# EAGLE design LCR (EAGLE 9.3.1)

## Sheet 1 of 3
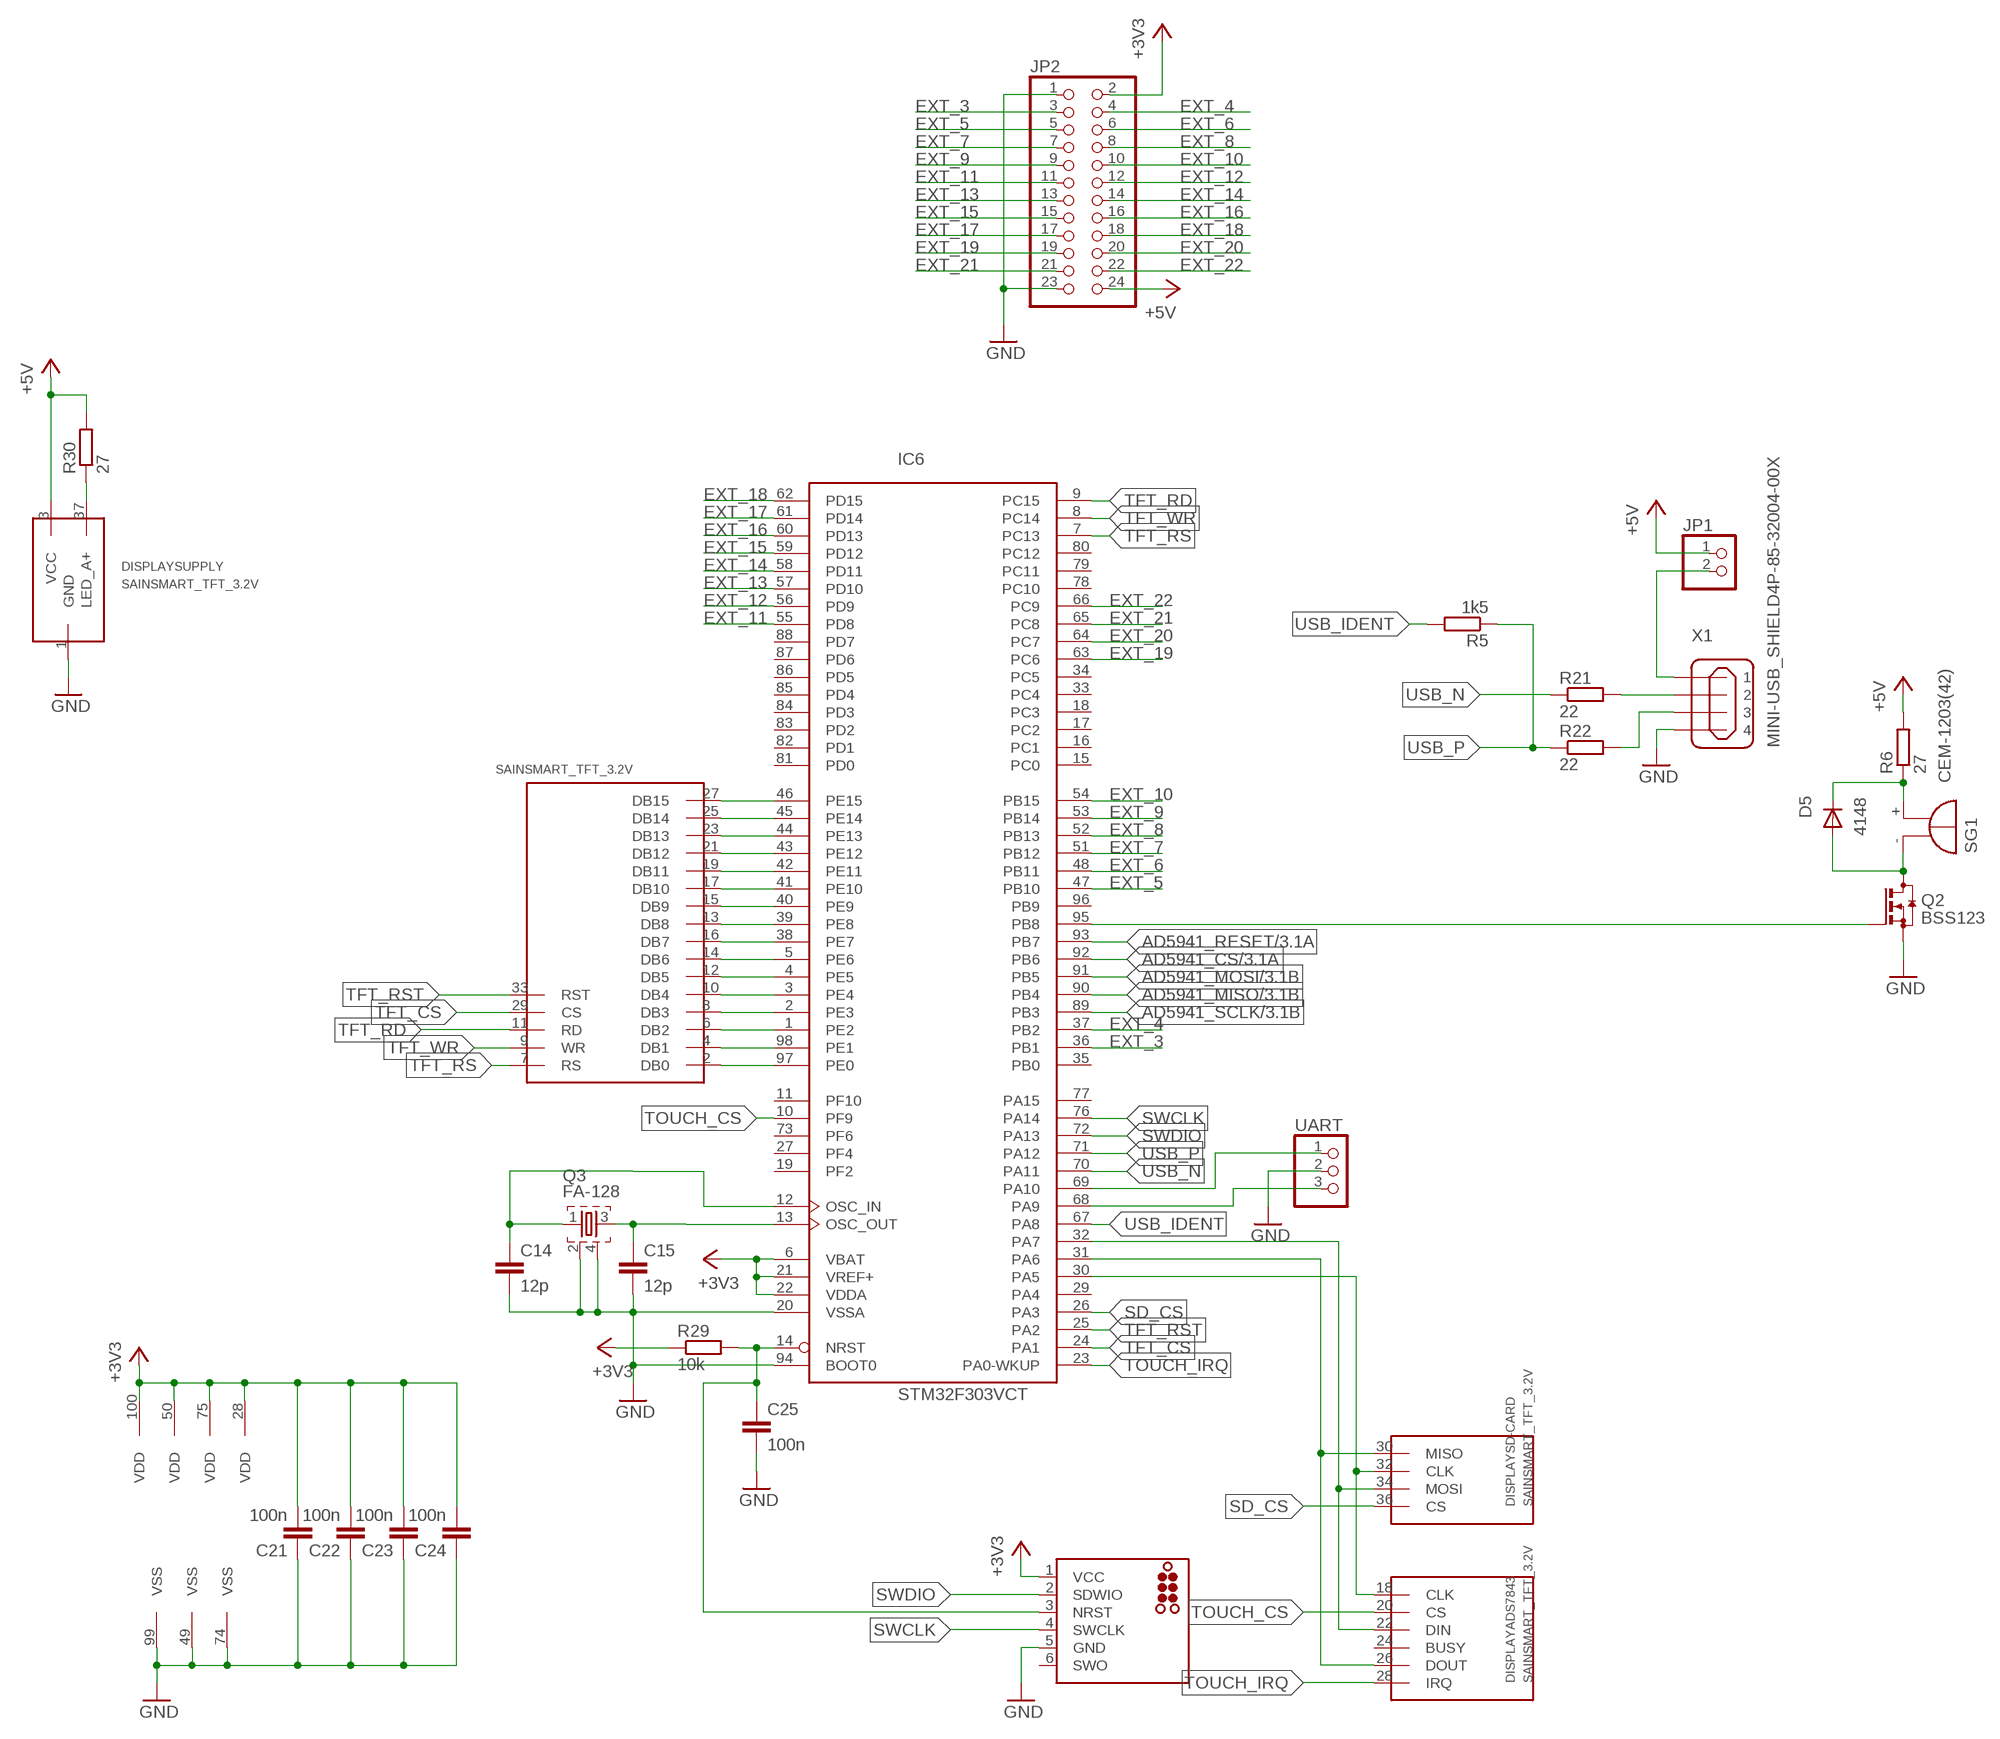
[diagram p0: schematic, sheet 1]

### Parts
C14  12p  C-EUC0603K  [C0603K]
C15  12p  C-EUC0603K  [C0603K]
C21  100n  C-EUC0603K  [C0603K]
C22  100n  C-EUC0603K  [C0603K]
C23  100n  C-EUC0603K  [C0603K]
C24  100n  C-EUC0603K  [C0603K]
C25  100n  C-EUC0603K  [C0603K]
D5  4148  DIODE-SOD123  [SOD123]
DISPLAY  SAINSMART_TFT_3.2V  [SAINSMART_ANGLED]
IC6  STM32F303VCT  [LQFP100]
J1  TC2030-MCP  [TC2030-MCP]
JP1  PINHD-1X2  [1X02]
JP2  PINHD-2X12  [2X12]
Q2  BSS123  [SOT23]
Q3  FA-128  [FA-128]
R5  1k5  R-EU_R0603  [R0603]
R6  27  R-EU_R1206  [R1206]
R21  22  R-EU_R0603  [R0603]
R22  22  R-EU_R0603  [R0603]
R29  10k  R-EU_R0603  [R0603]
R30  27  R-EU_R1206  [R1206]
SG1  CEM-1203(42)  F/QMBIII  [F/QMBIII]
UART  PINHD-1X3  [1X03]
X1  MINI-USB_SHIELD4P-85-32004-00X  [85-32004-00X]

### Nets
+3V3: C21.2 C22.2 C23.2 C24.2 IC6.6(VBAT) IC6.21(VREF+) IC6.22(VDDA) IC6.28(VDD) IC6.50(VDD) IC6.75(VDD) IC6.100(VDD) J1.1(VCC) JP2.2 R29.1 ; also sheet 2,3
+5V: DISPLAY.3(SUPPLY:VCC) JP1.1 JP2.24 R6.2 R30.2 ; also sheet 2
AD5941_CS: IC6.92(PB6) ; also sheet 3
AD5941_MISO: IC6.90(PB4) ; also sheet 3
AD5941_MOSI: IC6.91(PB5) ; also sheet 3
AD5941_RESET: IC6.93(PB7) ; also sheet 3
AD5941_SCLK: IC6.89(PB3) ; also sheet 3
EXT_3: IC6.36(PB1) JP2.3
EXT_4: IC6.37(PB2) JP2.4
EXT_5: IC6.47(PB10) JP2.5
EXT_6: IC6.48(PB11) JP2.6
EXT_7: IC6.51(PB12) JP2.7
EXT_8: IC6.52(PB13) JP2.8
EXT_9: IC6.53(PB14) JP2.9
EXT_10: IC6.54(PB15) JP2.10
EXT_11: IC6.55(PD8) JP2.11
EXT_12: IC6.56(PD9) JP2.12
EXT_13: IC6.57(PD10) JP2.13
EXT_14: IC6.58(PD11) JP2.14
EXT_15: IC6.59(PD12) JP2.15
EXT_16: IC6.60(PD13) JP2.16
EXT_17: IC6.61(PD14) JP2.17
EXT_18: IC6.62(PD15) JP2.18
EXT_19: IC6.63(PC6) JP2.19
EXT_20: IC6.64(PC7) JP2.20
EXT_21: IC6.65(PC8) JP2.21
EXT_22: IC6.66(PC9) JP2.22
GND: C14.2 C15.2 C21.1 C22.1 C23.1 C24.1 C25.2 DISPLAY.1(SUPPLY:GND) IC6.20(VSSA) IC6.49(VSS) IC6.74(VSS) IC6.94(BOOT0) IC6.99(VSS) J1.5(GND) JP2.1 JP2.23 Q2.2(S) Q3.2 Q3.4 UART.2 X1.4 ; also sheet 2,3
N$38: IC6.95(PB8) Q2.1(G)
N$41: DISPLAY.2(SSD1289:DB0) IC6.97(PE0)
N$43: DISPLAY.4(SSD1289:DB1) IC6.98(PE1)
N$44: DISPLAY.6(SSD1289:DB2) IC6.1(PE2)
N$45: DISPLAY.8(SSD1289:DB3) IC6.2(PE3)
N$46: DISPLAY.22(ADS7843:DIN) DISPLAY.34(SD-CARD:MOSI) IC6.32(PA7)
N$47: DISPLAY.10(SSD1289:DB4) IC6.3(PE4)
N$48: DISPLAY.12(SSD1289:DB5) IC6.4(PE5)
N$49: DISPLAY.14(SSD1289:DB6) IC6.5(PE6)
N$50: DISPLAY.16(SSD1289:DB7) IC6.38(PE7)
N$51: DISPLAY.26(ADS7843:DOUT) DISPLAY.30(SD-CARD:MISO) IC6.31(PA6)
N$52: DISPLAY.18(ADS7843:CLK) DISPLAY.32(SD-CARD:CLK) IC6.30(PA5)
N$53: C14.1 IC6.12(OSC_IN) Q3.1
N$54: C15.1 IC6.13(OSC_OUT) Q3.3
N$55: R21.2 X1.2
N$56: R22.2 X1.3
N$60: C25.1 IC6.14(NRST) J1.3(NRST) R29.2
N$61: DISPLAY.37(SUPPLY:LED_A+) R30.1
N$62: DISPLAY.13(SSD1289:DB8) IC6.39(PE8)
N$63: DISPLAY.15(SSD1289:DB9) IC6.40(PE9)
N$64: DISPLAY.17(SSD1289:DB10) IC6.41(PE10)
N$65: DISPLAY.19(SSD1289:DB11) IC6.42(PE11)
N$66: JP1.2 X1.1
N$67: D5.C R6.1 SG1.+(-)
N$68: DISPLAY.21(SSD1289:DB12) IC6.43(PE12)
N$69: DISPLAY.23(SSD1289:DB13) IC6.44(PE13)
N$70: DISPLAY.25(SSD1289:DB14) IC6.45(PE14)
N$71: DISPLAY.27(SSD1289:DB15) IC6.46(PE15)
N$72: D5.A Q2.3(D) SG1.-(+)
RX: IC6.69(PA10) UART.1
SD_CS: DISPLAY.36(SD-CARD:CS) IC6.26(PA3)
SWCLK: IC6.76(PA14) J1.4(SWCLK)
SWDIO: IC6.72(PA13) J1.2(SDWIO)
TFT_CS: DISPLAY.29(SSD1289:CS) IC6.24(PA1)
TFT_RD: DISPLAY.11(SSD1289:RD) IC6.9(PC15)
TFT_RS: DISPLAY.7(SSD1289:RS) IC6.7(PC13)
TFT_RST: DISPLAY.33(SSD1289:RST) IC6.25(PA2)
TFT_WR: DISPLAY.9(SSD1289:WR) IC6.8(PC14)
TOUCH_CS: DISPLAY.20(ADS7843:CS) IC6.10(PF9)
TOUCH_IRQ: DISPLAY.28(ADS7843:IRQ) IC6.23(PA0-WKUP)
TX: IC6.68(PA9) UART.3
USB_IDENT: IC6.67(PA8) R5.2
USB_N: IC6.70(PA11) R21.1
USB_P: IC6.71(PA12) R5.1 R22.1
Unconnected: DISPLAY.24(ADS7843:BUSY) IC6.11(PF10) IC6.15(PC0) IC6.16(PC1) IC6.17(PC2) IC6.18(PC3) IC6.19(PF2) IC6.27(PF4) IC6.29(PA4) IC6.33(PC4) IC6.34(PC5) IC6.35(PB0) IC6.73(PF6) IC6.77(PA15) IC6.78(PC10) IC6.79(PC11) IC6.80(PC12) IC6.81(PD0) IC6.82(PD1) IC6.83(PD2) IC6.84(PD3) IC6.85(PD4) IC6.86(PD5) IC6.87(PD6) IC6.88(PD7) IC6.96(PB9) J1.6(SWO) X1.M1(S1) X1.M2(S2)

## Sheet 2 of 3
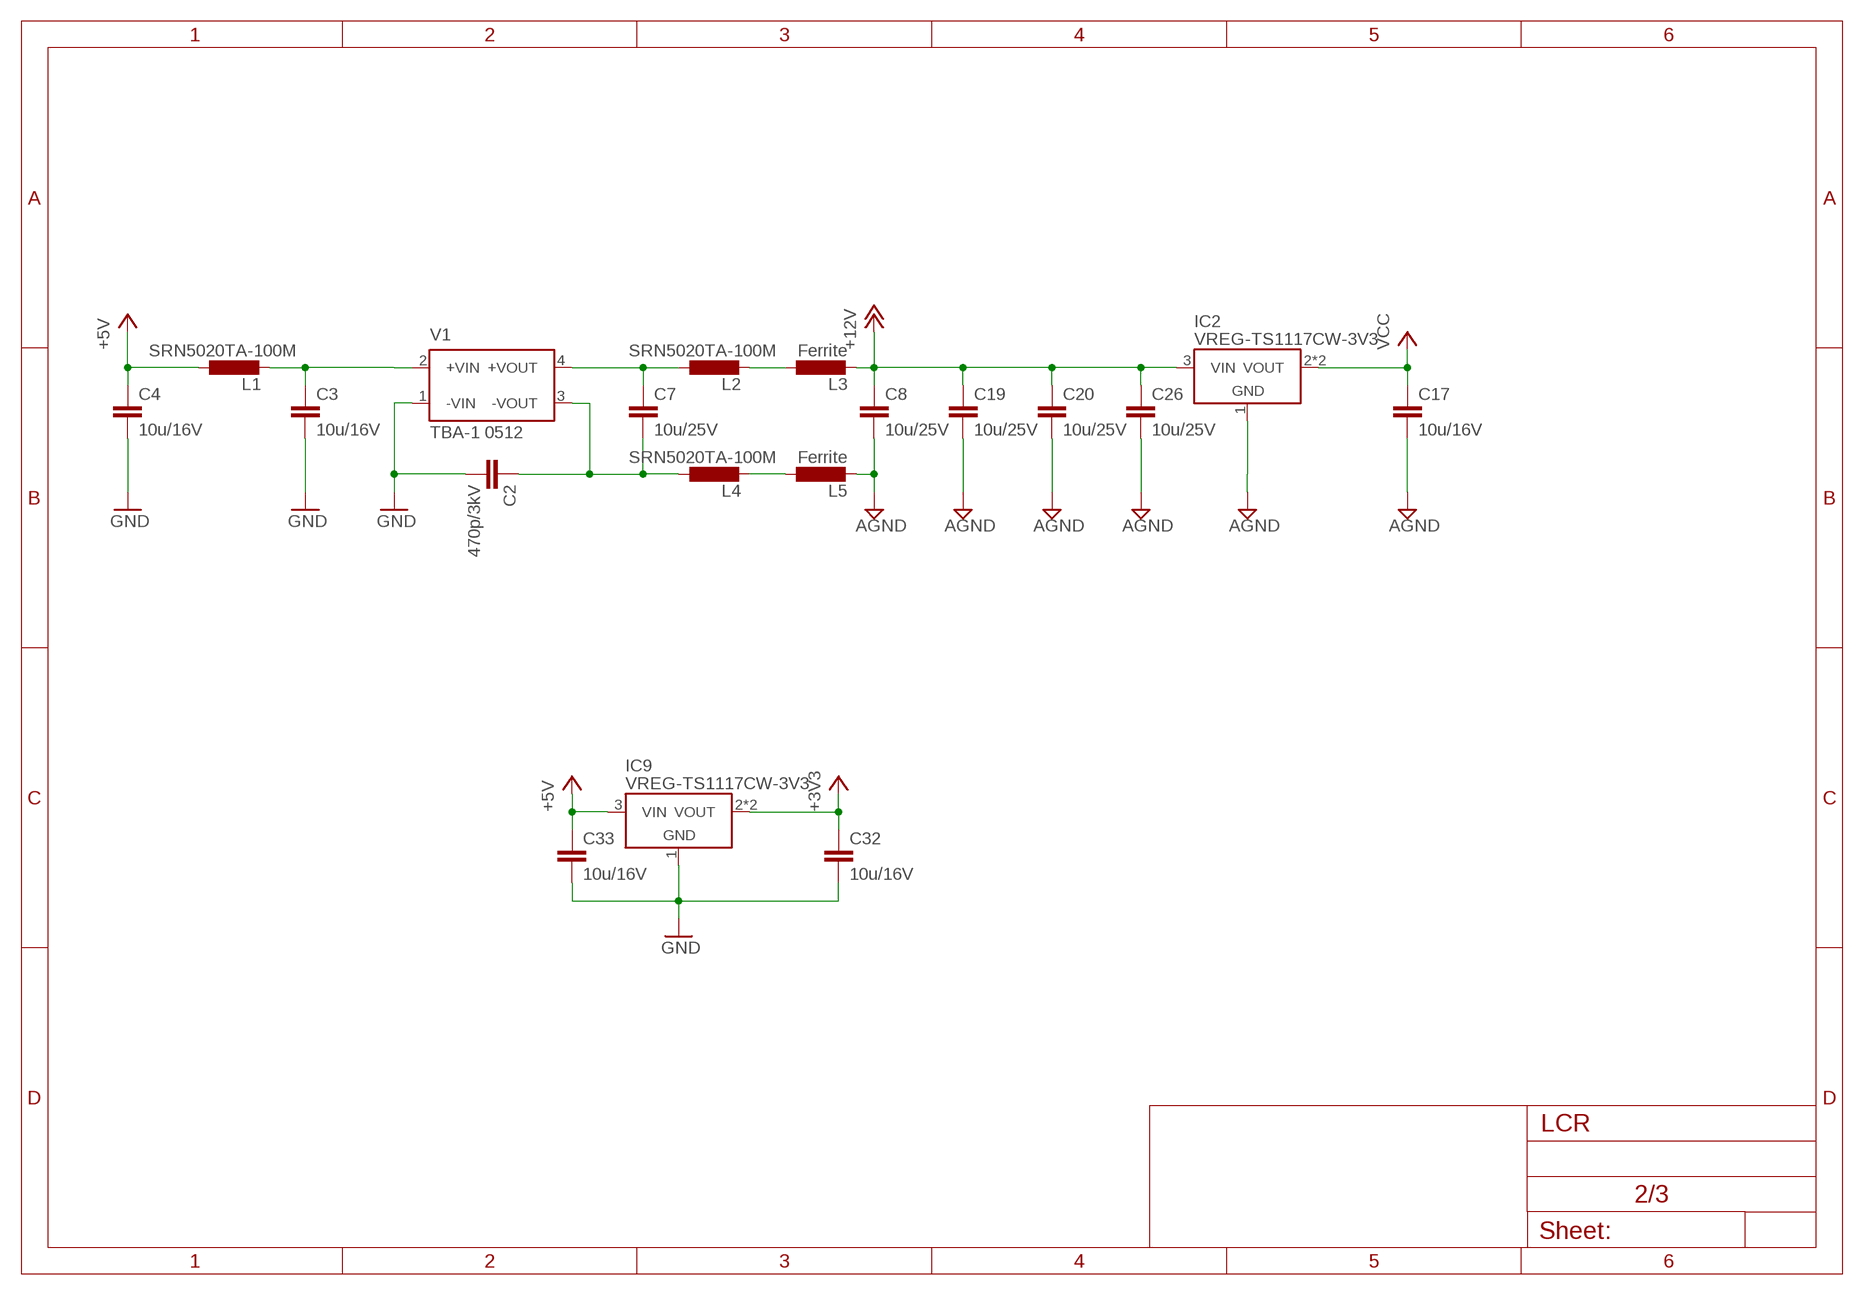
[diagram p1: schematic, sheet 2]

### Parts
C2  470p/3kV  C-EUC1812  [C1812]
C3  10u/16V  C-EUC1206K  [C1206K]
C4  10u/16V  C-EUC1206K  [C1206K]
C7  10u/25V  C-EUC1206K  [C1206K]
C8  10u/25V  C-EUC1206K  [C1206K]
C17  10u/16V  C-EUC1206K  [C1206K]
C19  10u/25V  C-EUC1206K  [C1206K]
C20  10u/25V  C-EUC1206K  [C1206K]
C26  10u/25V  C-EUC1206K  [C1206K]
C32  10u/16V  C-EUC1206K  [C1206K]
C33  10u/16V  C-EUC1206K  [C1206K]
IC2  VREG-TS1117CW-3V3  [SOT223]
IC9  VREG-TS1117CW-3V3  [SOT223]
L1  SRN5020TA-100M  SRN5040  [SRN5040]
L2  SRN5020TA-100M  SRN5040  [SRN5040]
L3  Ferrite  INDUCTOR0603  [R0603]
L4  SRN5020TA-100M  SRN5040  [SRN5040]
L5  Ferrite  INDUCTOR0603  [R0603]
V1  TBA-1 0512  TME0505S  [TME]

### Nets
+3V3: C32.1 IC9.2(VOUT) IC9.4(VOUT) ; also sheet 1,3
+5V: C4.1 C33.1 IC9.3(VIN) L1.P$1 ; also sheet 1
+12V: C8.1 C19.1 C20.1 C26.1 IC2.3(VIN) L3.2 ; also sheet 3
AGND: C8.2 C17.2 C19.2 C20.2 C26.2 IC2.1(GND) L5.2 ; also sheet 3
GND: C2.2 C3.2 C4.2 C32.2 C33.2 IC9.1(GND) V1.1(-VIN) ; also sheet 1,3
N$20: C3.1 L1.P$2 V1.2(+VIN)
N$25: C7.1 L2.P$1 V1.4(+VOUT)
N$26: C2.1 C7.2 L4.P$1 V1.3(-VOUT)
N$36: L2.P$2 L3.1
N$58: L4.P$2 L5.1
VCC: C17.1 IC2.2(VOUT) IC2.4(VOUT) ; also sheet 3

## Sheet 3 of 3
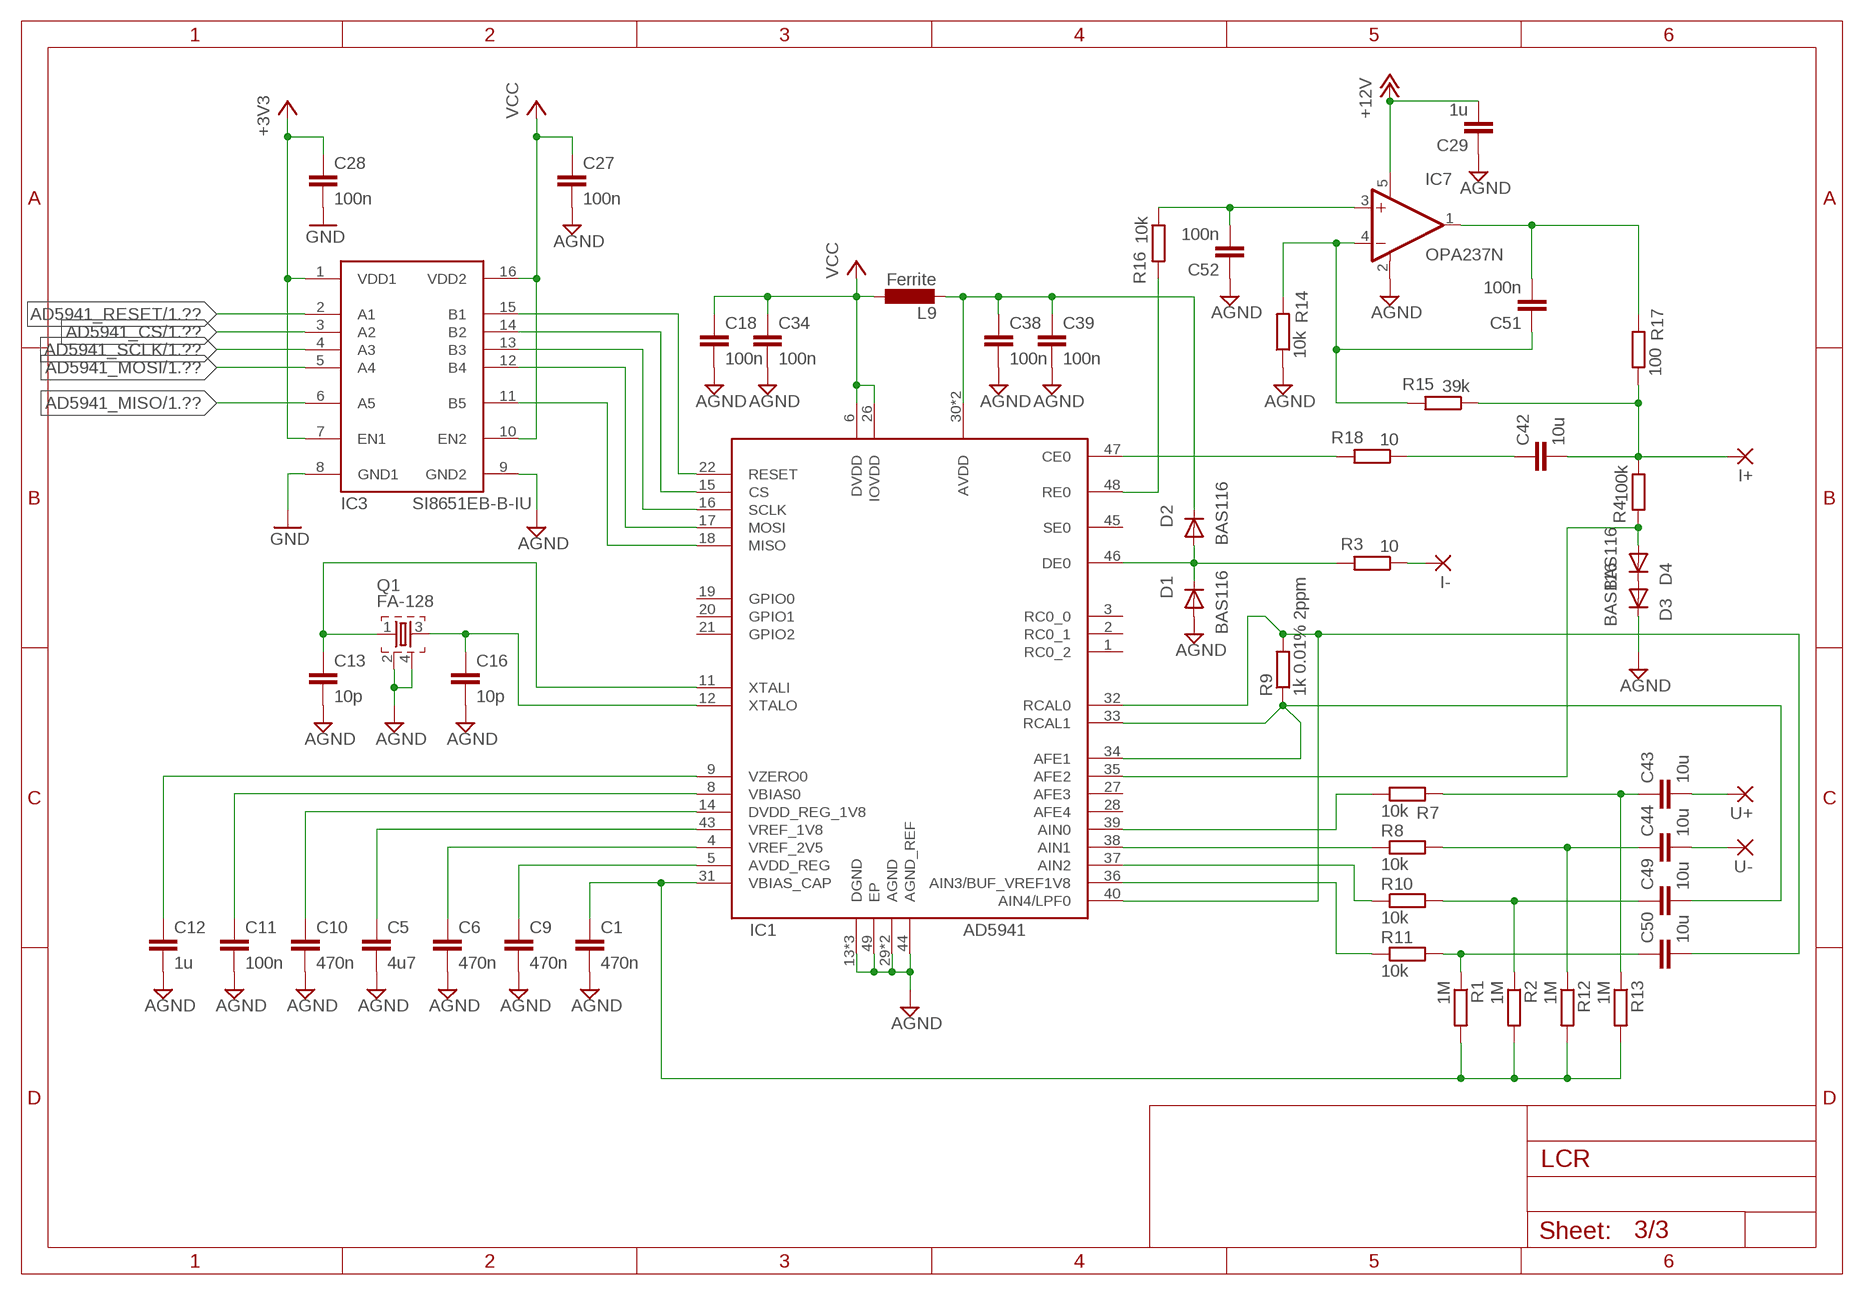
[diagram p2: schematic, sheet 3]

### Parts
C1  470n  C-EUC0603K  [C0603K]
C5  4u7  C-EUC0603K  [C0603K]
C6  470n  C-EUC0603K  [C0603K]
C9  470n  C-EUC0603K  [C0603K]
C10  470n  C-EUC0603K  [C0603K]
C11  100n  C-EUC0603K  [C0603K]
C12  1u  C-EUC0603K  [C0603K]
C13  10p  C-EUC0603K  [C0603K]
C16  10p  C-EUC0603K  [C0603K]
C18  100n  C-EUC0603K  [C0603K]
C27  100n  C-EUC0603K  [C0603K]
C28  100n  C-EUC0603K  [C0603K]
C29  1u  C-EUC0603K  [C0603K]
C34  100n  C-EUC0603K  [C0603K]
C38  100n  C-EUC0603K  [C0603K]
C39  100n  C-EUC0603K  [C0603K]
C42  10u  C-EUC1206K  [C1206K]
C43  10u  C-EUC1206K  [C1206K]
C44  10u  C-EUC1206K  [C1206K]
C49  10u  C-EUC1206K  [C1206K]
C50  10u  C-EUC1206K  [C1206K]
C51  100n  C-EUC0603K  [C0603K]
C52  100n  C-EUC0603K  [C0603K]
D1  BAS116  DIODE-SOD123  [SOD123]
D2  BAS116  DIODE-SOD123  [SOD123]
D3  BAS116  DIODE-SOD123  [SOD123]
D4  BAS116  DIODE-SOD123  [SOD123]
I+  2,54/1,1  [2,54/1,1]
I-  2,54/1,1  [2,54/1,1]
IC1  AD5941  [QFN50P700X700X80-49T510N]
IC3  SI8651EB-B-IU  [SOP63P600X175-16N]
IC7  OPA237N  [SOT23-5]
L9  Ferrite  INDUCTOR0603  [R0603]
Q1  FA-128  [FA-128]
R1  1M  R-EU_R0603  [R0603]
R2  1M  R-EU_R0603  [R0603]
R3  10  R-EU_R0603  [R0603]
R4  100k  R-EU_R0603  [R0603]
R7  10k  R-EU_R0603  [R0603]
R8  10k  R-EU_R0603  [R0603]
R9  1k 0.01% 2ppm  R-EU_M0805  [M0805]
R10  10k  R-EU_R0603  [R0603]
R11  10k  R-EU_R0603  [R0603]
R12  1M  R-EU_R0603  [R0603]
R13  1M  R-EU_R0603  [R0603]
R14  10k  R-EU_R0603  [R0603]
R15  39k  R-EU_R0603  [R0603]
R16  10k  R-EU_R0603  [R0603]
R17  100  R-EU_R0603  [R0603]
R18  10  R-EU_R0603  [R0603]
U+  2,54/1,1  [2,54/1,1]
U-  2,54/1,1  [2,54/1,1]

### Nets
+3V3: C28.1 IC3.1(VDD1) IC3.7(EN1) ; also sheet 1,2
+12V: C29.2 IC7.5(V+) ; also sheet 2
AD5941_CS: IC3.3(A2) ; also sheet 1
AD5941_MISO: IC3.6(A5) ; also sheet 1
AD5941_MOSI: IC3.5(A4) ; also sheet 1
AD5941_RESET: IC3.2(A1) ; also sheet 1
AD5941_SCLK: IC3.4(A3) ; also sheet 1
AGND: C1.2 C5.2 C6.2 C9.2 C10.2 C11.2 C12.2 C13.2 C16.2 C18.2 C27.2 C29.1 C34.2 C38.2 C39.2 C52.1 D1.A D3.C IC1.13(DGND) IC1.23(DGND) IC1.25(DGND) IC1.29(AGND) IC1.42(AGND) IC1.44(AGND_REF) IC1.49(EP) IC3.9(GND2) IC7.2(V-) Q1.2 Q1.4 R14.1 ; also sheet 2
GND: C28.2 IC3.8(GND1) ; also sheet 1,2
I+: C42.2 I+.1(P) R4.1 R15.1 R17.1
I-: I-.1(P) R3.1
N$1: C1.1 IC1.31(VBIAS_CAP) R1.2 R2.2 R12.2 R13.2
N$2: C6.1 IC1.4(VREF_2V5)
N$3: C5.1 IC1.43(VREF_1V8)
N$4: C9.1 IC1.5(AVDD_REG)
N$5: C10.1 IC1.14(DVDD_REG_1V8)
N$6: C11.1 IC1.8(VBIAS0)
N$7: C12.1 IC1.9(VZERO0)
N$8: C16.1 IC1.12(XTALO) Q1.3
N$9: C13.1 IC1.11(XTALI) Q1.1
N$10: IC1.17(MOSI) IC3.12(B4)
N$11: C42.1 R18.1
N$12: IC1.22(RESET) IC3.15(B1)
N$13: IC1.15(CS) IC3.14(B2)
N$14: IC1.16(SCLK) IC3.13(B3)
N$15: IC1.18(MISO) IC3.11(B5)
N$16: C38.1 C39.1 D2.C IC1.30(AVDD) IC1.41(AVDD) L9.2
N$17: IC1.47(CE0) R18.2
N$18: IC1.39(AIN0) R7.1
N$19: IC1.38(AIN1) R8.1
N$21: C44.1 R8.2 R12.1
N$23: C43.1 R7.2 R13.1
N$24: C49.2 IC1.33(RCAL1) IC1.34(AFE1) R9.1
N$27: IC1.37(AIN2) R10.1
N$28: IC1.36(AIN3/BUF_VREF1V8) R11.1
N$29: C50.1 R1.1 R11.2
N$30: C49.1 R2.1 R10.2
N$31: IC1.48(RE0) R16.2
N$32: C52.2 IC7.3(+IN) R16.1
N$33: C51.1 IC7.4(-IN) R14.2 R15.2
N$34: C51.2 IC7.1(OUT) R17.2
N$35: D1.C D2.A IC1.46(DE0) R3.2
N$37: D4.A IC1.35(AFE2) R4.2
N$39: D3.A D4.C
N$59: C50.2 IC1.32(RCAL0) IC1.40(AIN4/LPF0) R9.2
U+: C43.2 U+.1(P)
U-: C44.2 U-.1(P)
VCC: C18.1 C27.1 C34.1 IC1.6(DVDD) IC1.26(IOVDD) IC3.10(EN2) IC3.16(VDD2) L9.1 ; also sheet 2
Unconnected: IC1.1(RC0_2) IC1.2(RC0_1) IC1.3(RC0_0) IC1.19(GPIO0) IC1.20(GPIO1) IC1.21(GPIO2) IC1.27(AFE3) IC1.28(AFE4) IC1.45(SE0)

## Library data of the parts
C1 C3-C29 C32-C34 C38 C39 C51 C52 = rcl:C-EU: CAPACITOR, European symbol
C2 C42-C44 C49 C50 = resistor:C-EU: CAPACITOR, European symbol
D1-D5 = diode:DIODE-: DIODE
DISPLAY = sainsmart:SAINSMART_TFT_3.2
I+ I- U+ U- = wirepad:2,54/1,1: THROUGH-HOLE PAD
IC1 = custom-ic:AD5941
IC2 IC9 = we-power-mod:VREG: Voltage Regulators (LDOs, Switching Converters...) LDOs Taiwan Semi TS1117 800mA max 15V - compatible On Semi NCP1117 1A max 20V - compatible Diodes AP2111H 0.6A max 6V (0.25V@0.6A) - compatible Diodes AP2114H 1A max 6V (0.45V@1A) Taiwan Semi TS9011 250mA max 12V - compatible Diodes AP2210 300mA max 15V - compatible Microchip MCP1700 250mA max 6.5V - compatible Microchip MCP1702 250mA max 13V - compatible Microchip MCP1703 250mA max 16V - compatible Microchip MCP1754 150mA max 16V Taiwan Semi TS5204 150mA max 16V (low noise) DC/DC Converter Modules Recom R-78Ex.x-1.0-W36 1A max 28V - compatible CUI V78xx-2000 2A max 18V Murata OKI-78SR-x.x/1.5-W36 1.5A max 36V
IC3 = custom-ic:SI8651
IC6 = micro-stm_v3:STM32F303V*T: ARM 32-bit Cortex™-M3 CPU 72 MHz maximum frequency 128 to 256 Kbytes of Flash memory 32 to 40 kbytes of SRAM 87 GPIOs 2.0 to 3.6 V application supply
IC7 = burr-brown:OPA237: Operational Amplifiers Single-Supply, MicroAmplifier(TM) Series; MF: TEXAS INSTRUMENTS; MPN: OPA237NA/250; OC_FARNELL: 4625298; OC_NEWARK: 35C1874
J1 = tag-connect:TC2030: TAG-CONNECT ICSP Connector Manufacturer: Tag-Connect <http://www.tag-connect.com> Cable for easy In-Circuit Serial Programming. Designed for Microchip ICD2, suitable for many others. Two variants - one "with legs" (for hands-free fit on PCB) and another "without legs" for quick programming. PAD Description 1 MCLR/Vpp 2 Vdd 3 GND 4 PGD (ISPDAT) 5 PGC (ISPCLK) 6 nc (used for LVP) ©2009 ROFA.cz - modified and updated by Robert Darlington ‹rdarlington@gmail.com›
JP1 = pinhead:PINHD-1X2: PIN HEADER
JP2 = pinhead:PINHD-2X12: PIN HEADER
L1 L2 L4 = custom-ic:SRN5040
L3 L5 L9 = rf:INDUCTOR
Q1 Q3 = crystal:FA-: MHz RANGE CRYSTAL UNIT Source: Epson Toyocom
Q2 = transistor-small-signal:BSS123: N-CHANNEL MOS FET
R1-R4 R7 R8 R10-R18 = rcl:R-EU_: RESISTOR, European symbol
R5 R6 R9 R21 R22 R29 R30 = resistor:R-EU_: RESISTOR, European symbol
SG1 = buzzer:F/QMBIII: BUZZER Source: Buerklin; OC_FARNELL: unknown; OC_NEWARK: unknown
UART = pinhead:PINHD-1X3: PIN HEADER
V1 = traco-electronic:TME?*: DC/DC Converter TME Series 1 Watt Source: www.tracopower.com .. tme.pdf; MPN: TME 0505S; OC_FARNELL: 1007538; OC_NEWARK: 51R5321
X1 = con-cypressindustries:MINI-USB_SHIELD4P-: MINI USB 4 Pol. Source: www.cypressindustries.com; OC_FARNELL: unknown; OC_NEWARK: unknown

## Board
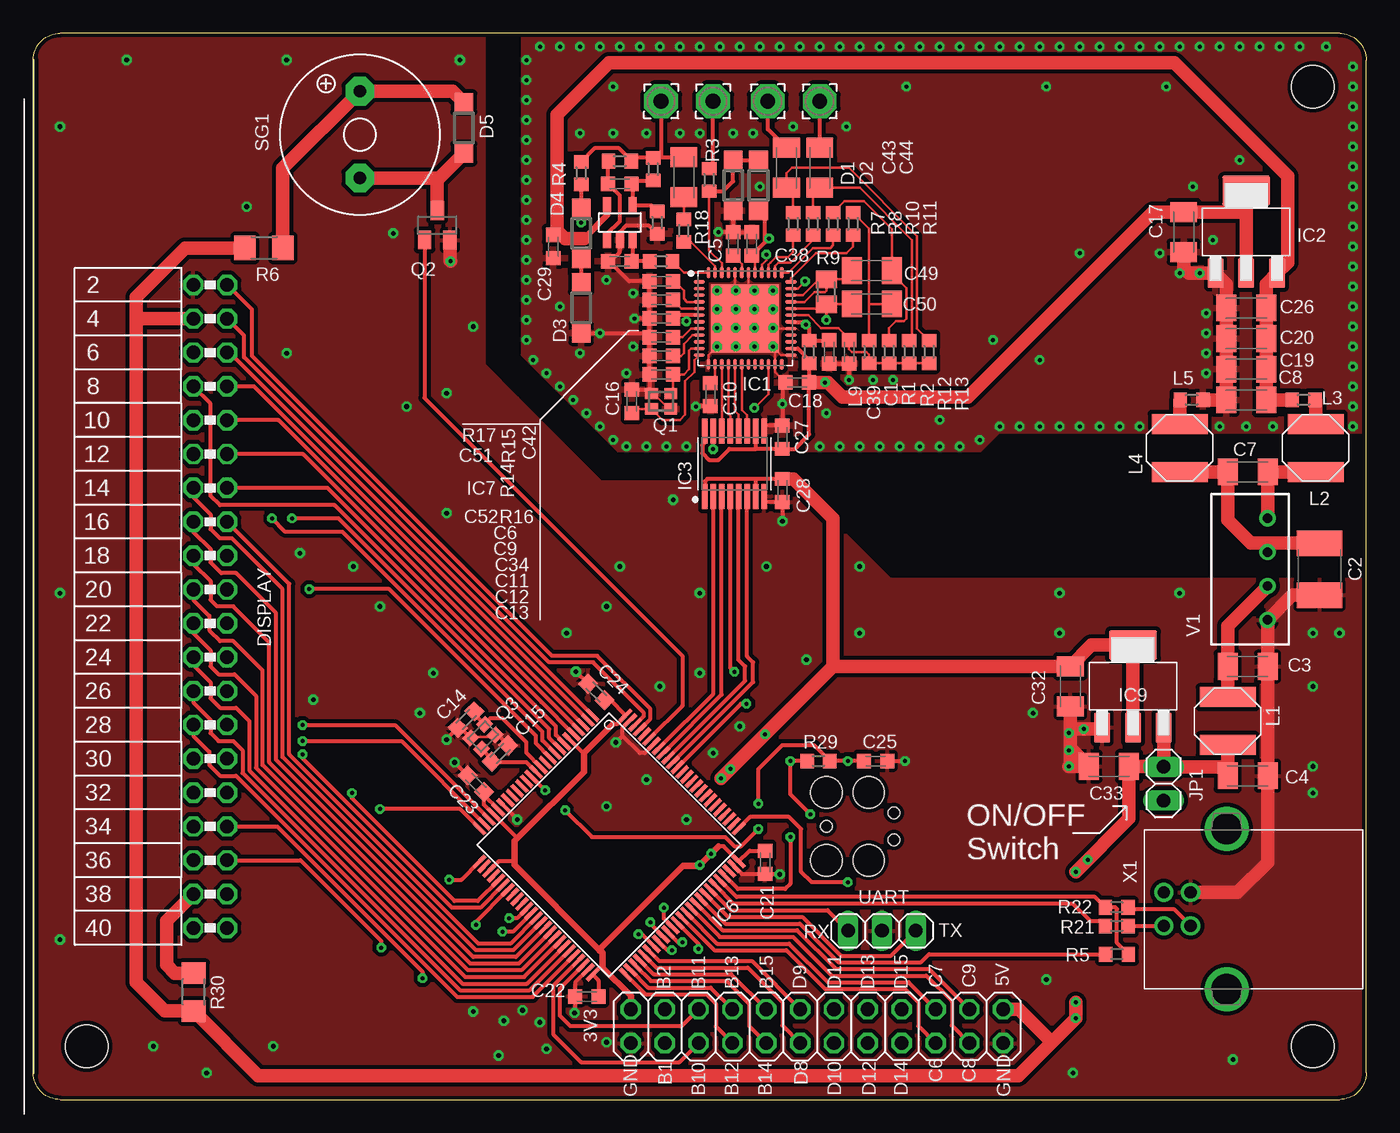
[diagram p3: board, top side]
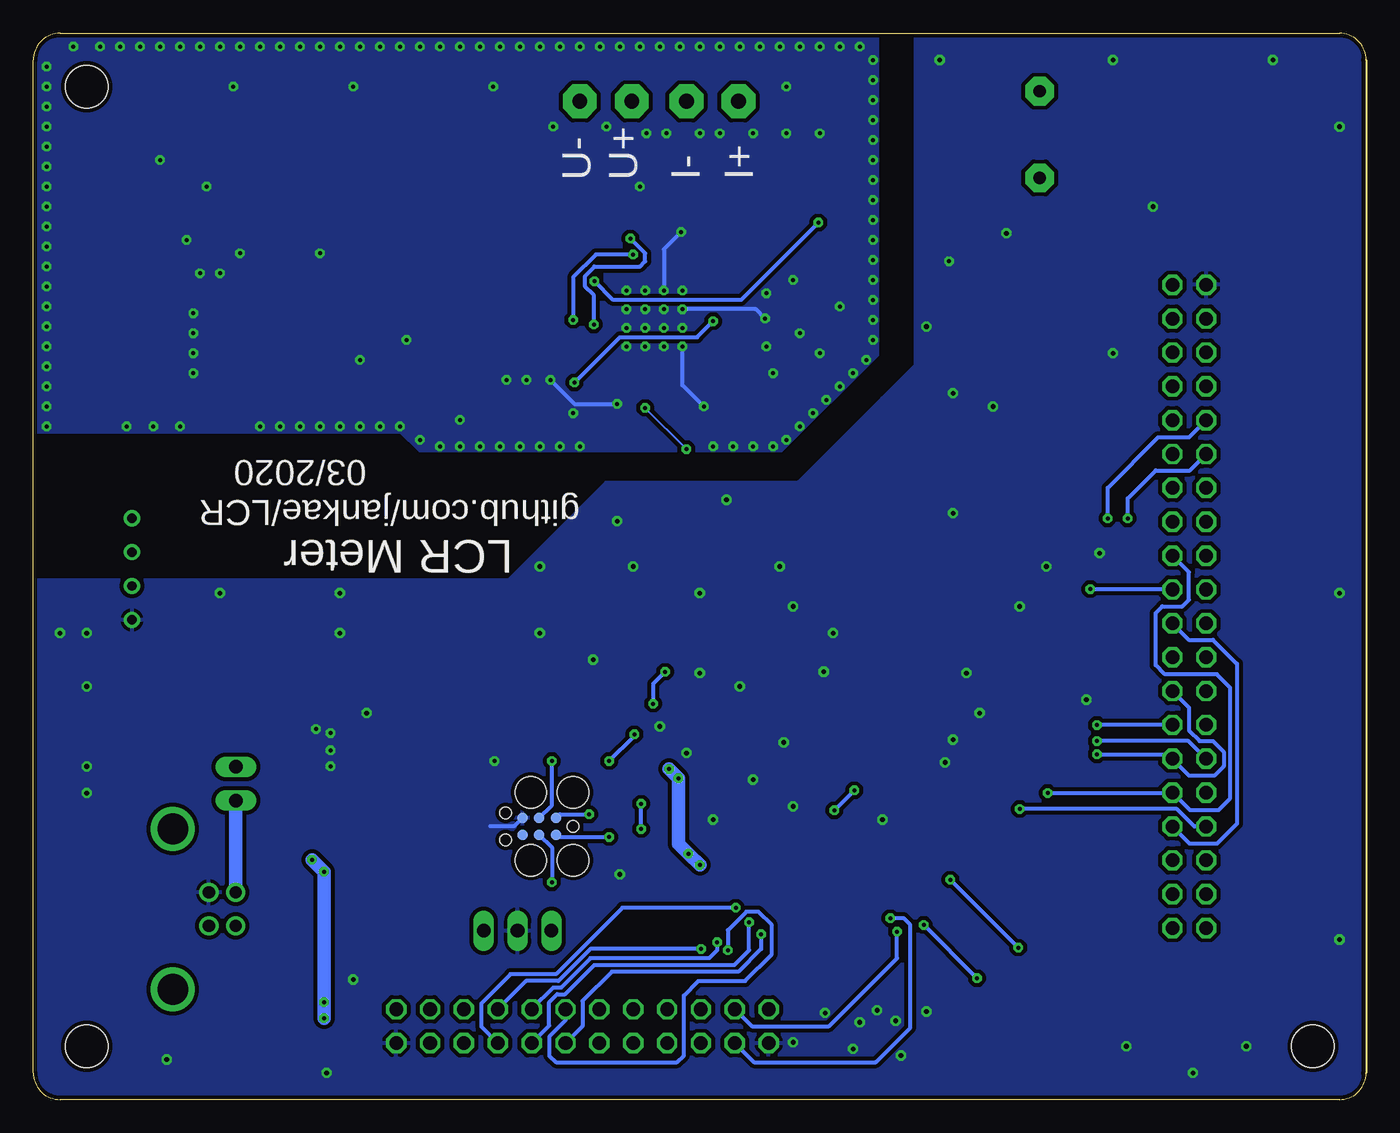
[diagram p4: board, bottom side, seen from below]

Size 100 x 80 mm. Coordinates in mm from the lower left corner, seen from the top.
Outline: 0,78 0,2
Outline: 0,78 0,2
Outline: 0,2 arc90 2,0 98,0 arc90 100,2 100,78 arc90 98,80 2,80 arc90 0,78
Copper layers (1*16): Top 0.035mm / dielectric 1.55mm / Bottom 0.035mm
Design rules "JLCPCB4L_7628 *": minimum track width 6mil, minimum drill 0.3mm, track to track 3.5mil, track to pad 3.5mil, pad to pad 3.5mil, via to via 3.5mil, smd to smd 0mil, copper to edge 0.2mm, drill to drill 0.2mm, minimum pad ring 10mil, minimum via ring 8mil, stop-mask expansion 4mil, vias tented up to drill 0mil, thermal gap 10mil
Holes 3.2 mm at 96,4 96,76 4,4
tKeepout: area 93,73 to 99,79; area 93,1 to 99,7; area 1,1 to 7,7

### Footprints (pad centres in the part's own frame; a part is rotated, then mirrored left to right if it is on the bottom)
C0603K = smd 1.05 x 1.08: 1 -0.875,0; 2 0.875,0
C1812 = smd 1.9 x 3.4: 1 -1.95,0; 2 1.95,0
C1206K = smd 1.5 x 2: 1 -1.5,0; 2 1.5,0
SOD123 = smd 1.4 x 1.4: A 1.9,0; C -1.9,0
SAINSMART_ANGLED = drill 1.016 octagon: 1 -24.13,0; 2 -24.13,2.54; 3 -21.59,0; 4 -21.59,2.54; 5 -19.05,0; 6 -19.05,2.54; 7 -16.51,0; 8 -16.51,2.54; 9 -13.97,0; 10 -13.97,2.54; 11 -11.43,0; 12 -11.43,2.54; 13 -8.89,0; 14 -8.89,2.54; 15 -6.35,0; 16 -6.35,2.54; 17 -3.81,0; 18 -3.81,2.54; 19 -1.27,0; 20 -1.27,2.54; 21 1.27,0; 22 1.27,2.54; 23 3.81,0; 24 3.81,2.54; 25 6.35,0; 26 6.35,2.54; 27 8.89,0; 28 8.89,2.54; 29 11.43,0; 30 11.43,2.54; 31 13.97,0; 32 13.97,2.54; 33 16.51,0; 34 16.51,2.54; 35 19.05,0; 36 19.05,2.54; 37 21.59,0; 38 21.59,2.54; 39 24.13,0; 40 24.13,2.54
2,54/1,1 = drill 1.118 pad 2.54 octagon: 1 0,0
QFN50P700X700X80-49T510N = smd 0.838 x 0.264: 1 -3.446,2.75; 2 -3.446,2.25; 3 -3.446,1.75; 4 -3.446,1.25; 5 -3.446,0.75; 6 -3.446,0.25; 7 -3.446,-0.25; 8 -3.446,-0.75; 9 -3.446,-1.25; 10 -3.446,-1.75; 11 -3.446,-2.25; 12 -3.446,-2.75; 25 3.446,-2.75; 26 3.446,-2.25; 27 3.446,-1.75; 28 3.446,-1.25; 29 3.446,-0.75; 30 3.446,-0.25; 31 3.446,0.25; 32 3.446,0.75; 33 3.446,1.25; 34 3.446,1.75; 35 3.446,2.25; 36 3.446,2.75 | smd 0.264 x 0.838: 13 -2.75,-3.446; 14 -2.25,-3.446; 15 -1.75,-3.446; 16 -1.25,-3.446; 17 -0.75,-3.446; 18 -0.25,-3.446; 19 0.25,-3.446; 20 0.75,-3.446; 21 1.25,-3.446; 22 1.75,-3.446; 23 2.25,-3.446; 24 2.75,-3.446; 37 2.75,3.446; 38 2.25,3.446; 39 1.75,3.446; 40 1.25,3.446; 41 0.75,3.446; 42 0.25,3.446; 43 -0.25,3.446; 44 -0.75,3.446; 45 -1.25,3.446; 46 -1.75,3.446; 47 -2.25,3.446; 48 -2.75,3.446 | smd 5.1 x 5.1: 49 0,0
SOT223 = smd 2.235 x 1.219: 1 -3.099,2.311; 2 -3.099,0; 3 -3.099,-2.311 | smd 2.2 x 3.6: 4 3.099,0
SOP63P600X175-16N = smd 1.901 x 0.41: 1 -2.455,2.223; 2 -2.455,1.587; 3 -2.455,0.953; 4 -2.455,0.318; 5 -2.455,-0.318; 6 -2.455,-0.953; 7 -2.455,-1.587; 8 -2.455,-2.223; 9 2.455,-2.223; 10 2.455,-1.587; 11 2.455,-0.953; 12 2.455,-0.318; 13 2.455,0.318; 14 2.455,0.953; 15 2.455,1.587; 16 2.455,2.223
LQFP100 = smd 0.3 x 1.2: 1 -6,-7.75; 2 -5.5,-7.75; 3 -5,-7.75; 4 -4.5,-7.75; 5 -4,-7.75; 6 -3.5,-7.75; 7 -3,-7.75; 8 -2.5,-7.75; 9 -2,-7.75; 10 -1.5,-7.75; 11 -1,-7.75; 12 -0.5,-7.75; 13 0,-7.75; 14 0.5,-7.75; 15 1,-7.75; 16 1.5,-7.75; 17 2,-7.75; 18 2.5,-7.75; 19 3,-7.75; 20 3.5,-7.75; 21 4,-7.75; 22 4.5,-7.75; 23 5,-7.75; 24 5.5,-7.75; 25 6,-7.75; 51 6,7.75; 52 5.5,7.75; 53 5,7.75; 54 4.5,7.75; 55 4,7.75; 56 3.5,7.75; 57 3,7.75; 58 2.5,7.75; 59 2,7.75; 60 1.5,7.75; 61 1,7.75; 62 0.5,7.75; 63 0,7.75; 64 -0.5,7.75; 65 -1,7.75; 66 -1.5,7.75; 67 -2,7.75; 68 -2.5,7.75; 69 -3,7.75; 70 -3.5,7.75; 71 -4,7.75; 72 -4.5,7.75; 73 -5,7.75; 74 -5.5,7.75; 75 -6,7.75 | smd 1.2 x 0.3: 26 7.75,-6; 27 7.75,-5.5; 28 7.75,-5; 29 7.75,-4.5; 30 7.75,-4; 31 7.75,-3.5; 32 7.75,-3; 33 7.75,-2.5; 34 7.75,-2; 35 7.75,-1.5; 36 7.75,-1; 37 7.75,-0.5; 38 7.75,0; 39 7.75,0.5; 40 7.75,1; 41 7.75,1.5; 42 7.75,2; 43 7.75,2.5; 44 7.75,3; 45 7.75,3.5; 46 7.75,4; 47 7.75,4.5; 48 7.75,5; 49 7.75,5.5; 50 7.75,6; 76 -7.75,6; 77 -7.75,5.5; 78 -7.75,5; 79 -7.75,4.5; 80 -7.75,4; 81 -7.75,3.5; 82 -7.75,3; 83 -7.75,2.5; 84 -7.75,2; 85 -7.75,1.5; 86 -7.75,1; 87 -7.75,0.5; 88 -7.75,0; 89 -7.75,-0.5; 90 -7.75,-1; 91 -7.75,-1.5; 92 -7.75,-2; 93 -7.75,-2.5; 94 -7.75,-3; 95 -7.75,-3.5; 96 -7.75,-4; 97 -7.75,-4.5; 98 -7.75,-5; 99 -7.75,-5.5; 100 -7.75,-6
SOT23-5 = smd 0.6 x 1.2: 1 -0.95,-1.306; 2 0,-1.306; 3 0.95,-1.306; 4 0.95,1.306; 5 -0.95,1.306
TC2030-MCP = smd 0.787 x 0.787: 1 1.27,-0.635; 2 1.27,0.635; 3 2.54,-0.635; 4 2.54,0.635; 5 3.81,-0.635; 6 3.81,0.635 | hole 0.889: 0,0; 5.08,-1.016; 5.08,1.016 | hole 2.375: 0,2.54; 0,-2.54; 3.175,-2.54; 3.175,2.54
1X02 = drill 1.016 long: 1 -1.27,0; 2 1.27,0
2X12 = drill 1.016 octagon: 1 -13.97,-1.27; 2 -13.97,1.27; 3 -11.43,-1.27; 4 -11.43,1.27; 5 -8.89,-1.27; 6 -8.89,1.27; 7 -6.35,-1.27; 8 -6.35,1.27; 9 -3.81,-1.27; 10 -3.81,1.27; 11 -1.27,-1.27; 12 -1.27,1.27; 13 1.27,-1.27; 14 1.27,1.27; 15 3.81,-1.27; 16 3.81,1.27; 17 6.35,-1.27; 18 6.35,1.27; 19 8.89,-1.27; 20 8.89,1.27; 21 11.43,-1.27; 22 11.43,1.27; 23 13.97,-1.27; 24 13.97,1.27
SRN5040 = smd 1.5 x 4.2: P$1 -1.8,0; P$2 1.8,0
R0603 = smd 1 x 1.1: 1 -0.85,0; 2 0.85,0
FA-128 = smd 0.95 x 0.85: 1 -0.725,-0.575; 2 0.725,-0.575; 3 0.725,0.575; 4 -0.725,0.575
SOT23 = smd 1 x 1.4: 1 -0.95,-1.1; 2 0.95,-1.1; 3 0,1.1
R1206 = smd 1.6 x 1.803: 1 -1.422,0; 2 1.422,0
M0805 = smd 1.3 x 1.6: 1 -0.95,0; 2 0.95,0
F/QMBIII = drill 0.914 pad 2.159 octagon: + 3.251,0; - -3.251,0
1X03 = drill 1.016 long: 1 -2.54,0; 2 0,0; 3 2.54,0
TME = drill 0.7 pad 1.1: 1 -3.81,0; 2 -1.27,0; 3 1.27,0; 4 3.81,0
85-32004-00X = drill 0.92 pad 1.27: 1 4.71,-1.25; 2 4.71,1.25; 3 2.71,1.25; 4 2.71,-1.25 | drill 2.3 pad 3: M1 0,6.02; M2 0,-6.02

### Placement (x,y rotation side)
C1  61.2,56.1 270 top
C2  96.5,39.8 270 top
C3  91.1,32.5 0 top
C4  91.1,24.3 0 top
C5  52.5,64.2 90 top
C6  47.1,61.4 180 top
C7  91.1,47.1 180 top
C8  91,52.5 180 top
C9  47.1,60 180 top
C10  50.8,52.9 270 top
C11  47.1,57.2 180 top
C12  47.1,55.8 180 top
C13  47.1,54.4 180 top
C14  32.47,28.51 225 top
C15  35.01,25.97 45 top
C16  44.9,52.4 90 top
C17  86.3,65.1 270 top
C18  57.3,53.8 180 top
C19  91,54.8 180 top
C20  91,57.1 180 top
C21  54.9,17.8 90 top
C22  41.53,7.73 0 top
C23  33.2,23.7 315 top
C24  42.24,30.58 315 top
C25  63.2,25.4 0 top
C26  91,59.4 180 top
C27  56.2,49.7 90 top
C28  56.2,45.7 270 top
C29  39,64 90 top
C32  77.8,31 270 top
C33  80.7,25 180 top
C34  47.1,58.6 180 top
C38  53.9,64.2 90 top
C39  59.7,56.1 270 top
C42  48.8,69.2 90 top
C43  56.5,69.9 90 top
C44  59,69.9 90 top
C49  62.9,62.2 180 top
C50  62.9,59.7 180 top
C51  44,68.7 180 top
C52  44,62.9 0 top
D1  52.5,68.6 270 top
D2  54.4,68.6 90 top
D3  41.1,59.4 90 top
D4  41.1,65 90 top
D5  32.3,72.9 270 top
DISPLAY  12,37 270 top
I+  47.1,74.9 90 top
I-  51,74.9 90 top
IC1  53.4,58.6 0 top
IC2  91,65.1 90 top
IC3  52.6,47.7 90 top
IC6  43.2,19.1 225 top
IC7  44,65.8 0 top
IC9  82.5,31 90 top
J1  59.5,20.5 180 bottom
JP1  84.8,23.7 270 top
JP2  58.8,5.5 0 top
L1  89.6,28.4 90 top
L2  96.2,48.9 90 top
L3  95.3,52.5 180 top
L4  86,48.9 90 top
L5  86.9,52.5 0 top
L9  58.2,56.1 90 top
Q1  47.1,52.4 180 top
Q2  30.3,65.6 0 top
Q3  33.74,27.24 225 top
R1  62.7,56.1 270 top
R2  64.2,56.1 270 top
R3  50.7,69 270 top
R4  41.1,69.5 270 top
R5  81.3,10.9 180 top
R6  17.3,63.9 180 top
R7  57,65.7 90 top
R8  58.5,65.7 90 top
R9  59.5,60.6 270 top
R10  60,65.7 90 top
R11  61.5,65.7 90 top
R12  65.7,56.1 270 top
R13  67.2,56.1 270 top
R14  46.8,65.8 90 top
R15  46.5,69.8 270 top
R16  47.1,62.9 0 top
R17  44,70.4 180 top
R18  48.8,65.2 270 top
R21  81.28,13.02 0 top
R22  81.28,14.42 0 top
R29  58.9,25.4 0 top
R30  12.04,8.06 270 top
SG1  24.5,72.4 90 top
U+  55.1,74.9 90 top
U-  59,74.9 90 top
UART  63.67,12.66 0 top
V1  92.6,39.8 90 top
X1  89.53,14.29 180 top

### Tracks (layer width: path | path; a pad name or v marks a point on that pad's centre or on a via)
+3V3  (via drill 0.3)
  Top 0.3: C28.1 54.2,46.58 | 54.2,46.58 50.58,46.58 50.38,46.38 IC3.1 | IC3.7 54.2,45.26 54.2,46.58 | IC6.21 33.82,22.82 C23.2 33.82,22.12 IC6.22 36.24,19.7 36.4,19.7 | C24.2 43.3,29.96 IC6.100 43.81,28.2 43.5,28.2 | C22.2 42.41,8.94 IC6.50 42.7,10.12 42.7,11 | C21.2 53.73,18.68 IC6.75 51.78,19 51.4,19 | IC6.6 41.25,26 41.3,26 | IC6.28 34.93,17.9 36.1,17.9 | R29.1 v56.8,25.4 56.8,22.9 v58.3,21.4
  Top 0.5: 51.4,19 v50.85,18.45 49.95,17.55 48.75,17.55 42.45,11.25 | 42.45,11.25 42.7,11 42.7,9.9 44.83,7.77 JP2.2 | 42.45,11.25 36.1,17.6 36.1,17.9 36.1,19.4 36.4,19.7 41.3,24.6 41.3,26 43.5,28.2
  Top 1: IC9.2 IC9.4 79.4,34.1 C32.1 60,32.5 | 60,32.5 v54.9,27.4 v51.6,24.1 | 60,32.5 60,43.6 57.02,46.58 C28.1
  Bottom 0.3: J1.1 60.51,21.4 v58.3,21.4 | v56.8,25.4 54.9,27.3 v54.9,27.4
  Bottom 1: v50,17.6 v50.85,18.45 51.6,19.2 v51.6,24.1 v52.3,24.8
+5V  (via drill 0.3)
  Top 1: JP1.1 IC9.3 | JP1.1 84.77,25 C33.1 82.2,21.1 v78.2,17.1 | JP1.1 89.57,24.97 | 89.57,24.97 89.6,25 L1.P$1 | C4.1 89.57,24.33 89.57,24.97 | 76.4,4.3 v78.2,6.1 v78.2,7.3 | 76.4,4.3 73.9,1.8 16.88,1.8 R30.2 9.86,6.64 7.7,8.8 7.7,58.6 | 7.7,58.6 DISPLAY.3 | R6.2 11.4,63.9 7.7,60.2 7.7,58.6 | JP2.24 73.93,6.77 76.4,4.3
  Bottom 1: v78.2,6.1 v78.2,17.1 v79.1,18
+12V
  Top 0.152: C29.2 39.3,65.17 39.3,65.2
  Top 0.5: 41.3,64.6 43.05,66.35 IC7.5
  Top 1: L3.2 C8.1 C19.1 C20.1 C26.1 92.5,61.19 IC2.3 94.1,62.79 94.1,69.3 85.6,77.8 43.2,77.8 39.3,73.9 39.3,65.2 39.9,64.6 41.3,64.6
AD5941_CS
  Top 0.3: IC6.92 51.65,30.38 IC3.3
AD5941_MISO
  Top 0.3: IC3.6 53.55,33.25 54,32.8 54,31.31 IC6.90
AD5941_MOSI
  Top 0.3: IC3.5 52.9,45.23 52.9,33 53.4,32.5 53.4,31.42 IC6.91
AD5941_RESET
  Top 0.3: IC6.93 51.01,30.45 IC3.2
AD5941_SCLK  (via drill 0.3)
  Top 0.3: IC3.4 52.28,32.42 v52.6,32.1 | v53.5,29.7 53.09,29.7 IC6.89
  Bottom 0.3: v52.6,32.1 53.5,31.2 v53.5,29.7
AGND  (via drill 0.3)
  Top 0.2: IC1.13 50.65,55.85 v51.3,56.5 53.25,58.45 | 53.25,58.45 IC1.49 | 55.65,56.3 IC1.23 55.65,54.58 C18.2 | 55.65,56.3 55.65,56.35 v55.5,56.5 54.2,57.8 54.15,57.85 | 53.6,58.4 54.15,57.85 | 53.55,58.45 53.6,58.4 | 53.55,58.45 53.5,58.5 | 53.5,58.5 IC1.49 | IC1.25 56.1,55.85 55.65,56.3 | IC1.29 55.4,57.85 54.6,57.85 54.15,57.85 | 53.6,58.4 54.15,57.85 | 53.55,58.45 53.6,58.4 | 53.55,58.45 53.5,58.5 | 53.5,58.5 IC1.49 | IC1.42 53.65,58.85 53.25,58.45 | IC1.44 52.65,60.7 52.65,59.35 53.5,58.5 | Q1.4 47.67,51.83 46.52,52.98 Q1.2
  Top 0.3: D1.A C5.2 | C5.2 C38.2 | C39.2 C1.2 v61.2,54 | C11.2 C12.2 C13.2 46.23,53.23 46.17,53.17 | C11.2 C34.2 | C34.2 C9.2 C6.2 44.7,61.4 43.2,62.9 | C52.1 43.2,62.9 | 43.2,62.9 43.3,62.9 44,63.6 IC7.2 44,65.1 44.5,65.6 46.15,65.6 R14.1 | C16.2 46.08,53.27 46.17,53.17 | 46.17,53.17 Q1.2 | D3.C 45.92,57.5 C11.2 | IC1.49 v52.7,59.3 v51.3,59.3 | IC1.49 52,58.6 v51.3,57.9 | IC1.49 v52.7,57.9 v52.7,56.5 | 53.55,58.45 53.6,58.4 | 53.6,58.4 54.15,57.85 | 54.15,57.85 54.2,57.8 IC1.49 | IC1.49 53.55,58.45 | 53.55,58.45 53.6,58.4 | 53.6,58.4 54.15,57.85 | 54.6,57.85 54.15,57.85 | 54.15,57.85 55.4,57.85 | v55.5,60.7 53.65,58.85 IC1.49 | IC1.49 53.55,58.45 | 53.55,58.45 53.6,58.4 | 53.6,58.4 54.15,57.85 | IC1.49 53.55,58.45 | IC1.49 53.6,58.4 | IC3.9 54.82,50.58 C27.2 v56.2,52.2 56.2,53.58 C18.2 | IC1.49 53.4,59.95 52.65,60.7 | IC1.49 v51.3,60.7 | 53.4,60 v52.7,60.7 | IC1.49 53.4,60 | IC1.49 53.4,60 | 53.4,60 v54.1,60.7 | IC1.49 v54.1,59.3 v55.5,59.3 | IC1.49 v54.1,57.9 v54.1,56.5 | C5.2 51.42,65.08 v51.4,65.1 | C34.2 v45.1,58.6 | C10.2 49.73,52.02 v49.7,52
  Top 1: L5.2 C8.2 C19.2 C20.2 C26.2 89.5,61.19 IC2.1 86.7,62 86.3,62.4 C17.2
  Bottom 0.3: v51.4,65.1 52.7,63.8 v52.7,60.7 | v45.1,58.6 45.8,59.3 v51.3,59.3 | v49.7,52 51.3,53.6 v51.3,56.5 | v61.2,54 59.4,52.2 v56.2,52.2
  other vias: 55.5,57.9 83,50.5 81.5,50.5 80,50.5 78.5,50.5 77,50.5 75.5,50.5 74,50.5 72.5,50.5 71,49.5 69.5,49 68,49 66.5,49 65,49 63.5,49 62,49 60.5,49 59,49 49,49 47.5,49 46,49 44.5,49 43.5,49.5 42.5,50.5 41.5,51.5 40.5,52.5 39.5,53.5 38.5,54.5 37.5,55.5 37,57 37,58.5 37,60 37,61.5 37,63 37,64.5 37,66 37,67.5 37,69 37,70.5 37,72 37,73.5 37,75 37,76.5 37,78 38,79 39.5,79 41,79 42.5,79 44,79 45.5,79 47,79 48.5,79 50,79 51.5,79 53,79 54.5,79 56,79 57.5,79 59,79 60.5,79 62,79 63.5,79 65,79 66.5,79 68,79 69.5,79 71,79 72.5,79 74,79 75.5,79 77,79 78.5,79 80,79 81.5,79 83,79 84.5,79 86,79 87.5,79 89,79 90.5,79 92,79 93.5,79 89,50.5 91,50.5 93,50.5 99,50.5 99,52 99,53.5 99,55 99,56.5 99,58 99,59.5 99,61 99,62.5 99,64 99,65.5 99,67 99,68.5 99,70 99,71.5 99,73 99,74.5 99,76 99,77.5 97,79 95,79 88,54.5 88,56 88,57.5 88,59 87.5,62 86,62 88.5,64.5 84.5,63.5 41,56 42.5,57.5 39.5,59.5 44.5,54.5 45,56.5 45,60.5 43,61.5 54.5,68.5 54,72.5 52.5,72.5 50,72.5 48.5,72.5 46,72.5 43.5,72.5 41,72.5 43.5,76 63,54 64.5,54 61,73 57,73 87,68.5 90.5,70.5 85,76 65.5,76 76,76 78.5,63.5 72,57 75.5,55.5 68,51 59.5,51.5
  pour Bottom (isolate 0.3): 100,80 36.8,80 36.8,55.9 43.9,48.8 71,48.8 72.4,50.2 100,50.2
  pour Top (isolate 0.3): 100,80 36.8,80 36.8,55.9 43.9,48.8 71,48.8 72.4,50.2 100,50.2
EXT_3  (via drill 0.3)
  Top 0.3: IC6.36 36.29,13.6 v35.7,13.6
  Bottom 0.3: JP2.3 45.94,2.8 36.8,2.8 34.2,5.4 34.2,13.1 34.7,13.6 v35.7,13.6
EXT_4  (via drill 0.3)
  Top 0.3: IC6.37 35.99,12.6 v35.2,12.6
  Bottom 0.3: JP2.4 46.1,5.5 40.3,5.5 35.2,10.6 v35.2,12.6
EXT_5
  Top 0.3: IC6.47 39,8.54 39,4.9 41.1,2.8 48.48,2.8 JP2.5
EXT_6
  Top 0.3: JP2.6 48.64,5.5 40.3,5.5 39.5,6.3 39.5,8.33 IC6.48
EXT_7
  Top 0.3: IC6.51 45.91,7.9 50.5,7.9 51.2,7.2 51.2,5.48 JP2.7
EXT_8
  Top 0.3: IC6.52 46.12,8.4 50.82,8.4 JP2.8
EXT_9
  Top 0.3: IC6.53 46.33,8.9 52,8.9 53.7,7.2 53.7,5.52 JP2.9
EXT_10
  Top 0.3: IC6.54 46.54,9.4 52.36,9.4 JP2.10
EXT_11
  Top 0.3: IC6.55 46.74,9.9 53.6,9.9 56.2,7.3 56.2,5.56 JP2.11
EXT_12
  Top 0.3: IC6.56 46.95,10.4 53.9,10.4 JP2.12
EXT_13  (via drill 0.3)
  Top 0.3: IC6.57 45.66,12.4 v45.4,12.4
  Bottom 0.3: v45.4,12.4 45.4,11.3 47.1,9.6 56.6,9.6 58.8,7.4 58.8,5.5 JP2.13
EXT_14  (via drill 0.3)
  Top 0.3: IC6.58 47.56,11.2 v47.9,11.2
  Bottom 0.3: JP2.14 60.07,5.93 61.3,4.7 61.3,3.3 60.8,2.8 51.7,2.8 51.2,3.3 51.2,7.8 50.1,8.9 46.6,8.9 44.6,10.9 44.6,13.1 45.6,14.1 46.5,14.1 47.9,12.7 v47.9,11.2
EXT_15  (via drill 0.3)
  Top 0.3: IC6.59 46.3,13.17 v46.3,13.3
  Bottom 0.3: JP2.15 61.3,5.54 61.3,7.3 60.7,7.9 60.1,7.9 57.9,10.1 47.4,10.1 46.3,11.2 v46.3,13.3
EXT_16  (via drill 0.3)
  Top 0.3: IC6.60 48.38,11.8 v48.7,11.8
  Bottom 0.3: v48.7,11.8 48.7,11.2 49.3,10.6 58.2,10.6 60.4,8.4 61,8.4 62.61,6.79 JP2.16
EXT_17  (via drill 0.3)
  Top 0.3: IC6.61 47.3,13.59 v47.3,14.4
  Bottom 0.3: v47.3,14.4 55.8,14.4 60.8,9.4 64.2,9.4 66.4,7.2 66.4,5.48 JP2.17
EXT_18  (via drill 0.3)
  Top 0.3: IC6.62 49.9,11.69 v49.9,11.3
  Bottom 0.3: v49.9,11.3 58.2,11.3 60.6,8.9 63.02,8.9 JP2.18
EXT_19
  Top 0.3: IC6.63 51.1,11.2 56.5,11.2 59.4,8.3 65.4,8.3 66.4,7.3 66.4,5.52 JP2.19
EXT_20
  Top 0.3: IC6.64 51.31,11.7 56.7,11.7 59.6,8.8 65.66,8.8 JP2.20
EXT_21
  Top 0.3: IC6.65 51.51,12.2 57,12.2 59.9,9.3 67,9.3 68.9,7.4 68.9,5.56 JP2.21
EXT_22
  Top 0.3: IC6.66 51.72,12.7 57.3,12.7 60.2,9.8 67.2,9.8 JP2.22
GND  (via drill 0.3, 0.35)
  Top 0.2: Q3.2 32.89,27.2 34.51,27.2 Q3.4
  Top 0.3: IC3.8 54.82,44.83 C28.2 v56.2,43.4 | Q3.4 34.87,27.35 C15.2 | Q3.2 32.06,27.89 C14.2 31,27.05 v31,27 | IC6.49 40.66,8.78 C22.1 40.66,6.5 v40.6,6.5 | IC6.74 53.15,16.93 C21.1 56,16.93 v56,16.9 | C24.1 40.72,32.1 v40.7,32.1 | IC6.94 45.86,26 45.5,26 44.2,27.3 | IC6.99 44.2,27.88 44.2,27.3 | 44.2,27.3 v43.7,26.8 | IC6.20 36.3,21.05 v36.3,21 | C23.1 v31.6,25.3 | v31.6,25.3 | C25.2 v65.4,25.4
  Top 1: X1.4 90.34,15.54 92.6,17.8 C4.2 C3.2 V1.1 94.46,37.85 C2.2 | 77.8,26.4 C33.2 v77.7,25 77.8,25.1 77.8,26.4 | 77.8,26.4 77.8,27.8 | 77.8,27.8 C32.2 | IC9.1 80.09,27.8 77.8,27.8 | Q2.2 31.25,62.95 v31.3,62.9
  Bottom 0.3: J1.5 63.95,20.5 65.7,20.5
  other vias: 77.7,26.2 77.7,27.5 78.8,27.8 43,4.3 38,5.8 36.7,6.7 38.5,3.8 35.3,5.9 34.9,3.3 33,6.6 62,40 62,35 77,35 77,38 86,38 96,35 98,35 96,23 96,25 96,31 75,29 90,3 78,2 76,9 13,2 18,4 9,4 49,21 43,22 46,24 51,26 53,28 58,33 55,40 48,45 50,32 50,38 44,40 47,31 43,37 40,35 31,53 33,58 28,52 31,44 19,56 27,65 16,67 19,78 32,78 7,78 2,73 2,38 2,12 26,37 24,40 20,41 21,30 30,32 29,29
  pour Bottom (isolate 0.3, rank 2): 100.8,-1.1 100.8,39 80.6,39 64.3,39 57,46.3 42.6,46.3 36.3,52.6 33.8,55.1 33.8,81.2 -11.4,81.2 -11.4,-3.5 100.8,-3.5
  pour Top (isolate 0.3, rank 2): 100.8,-1.1 100.8,39 80.6,39 64.3,39 57,46.3 42.6,46.3 36.3,52.6 33.8,55.1 33.8,81.2 -11.4,81.2 -11.4,-3.5 100.8,-3.5
I+
  Top 0.3: C42.2 48.75,70.65 46.9,70.65 | 46.9,70.65 R15.1 45.1,70.65 44.88,70.42 | 44.88,70.42 R17.1 | I+.1 47.1,70.85 46.9,70.65 | R4.1 42.15,71.4 43.9,71.4 44.88,70.42
I-
  Top 0.2: R3.1 51,70.15
  Top 0.3: 51,70.15 I-.1
N$1
  Top 0.2: IC1.31 58.15,58.85 59.1,57.9 60.4,57.9 61.2,57.1 C1.1 61.2,56.3 61.4,56.1 62.5,56.1 62.7,55.9 R1.2 R2.2 R12.2 R13.2
N$2
  Top 0.2: IC1.4 49.05,59.85 48.8,60.1 48.8,60.7 48.1,61.4 C6.1
N$3
  Top 0.2: IC1.43 53.15,62.67 C5.1
N$4
  Top 0.2: IC1.5 48.62,59.35 C9.1
N$5
  Top 0.2: IC1.14 51.15,54.12 C10.1
N$6
  Top 0.2: IC1.8 49.35,57.85 48.7,57.2 C11.1
N$7
  Top 0.2: IC1.9 49.45,57.35 48.8,56.7 48.8,56 48.6,55.8 C12.1
N$8
  Top 0.2: IC1.12 49.6,55.5 49.6,54.6 48.9,53.9 48.9,51.4 48.5,51 47.2,51 Q1.3 45.2,51.83 C16.1
N$9
  Top 0.2: IC1.11 49.35,56.35 49.2,56.2 49.2,54.8 48.8,54.4 C13.1 47.98,53.12 Q1.1
N$10
  Top 0.2: IC1.17 52.65,51.65 52.92,51.38 IC3.12
N$11
  Top 0.2: R18.1 C42.1
N$12  (via drill 0.3)
  Top 0.2: IC3.15 51.01,48.81 v51,48.8 | v54.1,51.9 55.15,52.95 IC1.22
  Bottom 0.2: v51,48.8 v54.1,51.9
N$13
  Top 0.2: IC1.15 IC3.14
N$14
  Top 0.2: IC1.16 52.15,51.45 52.3,51.3 52.3,50.17 IC3.13
N$15
  Top 0.2: IC1.18 53.15,51.75 53.55,51.35 IC3.11
N$16  (via drill 0.3)
  Top 0.2: IC1.41 54.15,63.08 C38.1
  Top 0.3: IC1.30 57.75,58.35 v57.95,58.15 58.2,57.9 L9.2 59.67,56.95 C39.1 | C38.1 54.9,64.33 54.9,64.6 | D2.C 54.9,66.2 54.9,64.6 | 54.9,64.6 v55.2,64.6
  Bottom 0.3: v57.95,58.15 57.95,60.35 58.6,61 58.6,61.8 57.9,62.5 54.5,62.5 54.1,62.9 54.1,63.5 v55.2,64.6
N$17
  Top 0.2: IC1.47 51.15,62.55 49.35,64.35 R18.2
N$18
  Top 0.2: IC1.39 55.15,62.64 55.29,62.78 55.29,62.79 55.7,63.2 56.6,63.2 57,63.6 R7.1
N$19
  Top 0.2: IC1.38 55.65,62.55 55.9,62.8 56.8,62.8 58.5,64.5 R8.1
N$20
  Top 1: L1.P$2 C3.1 89.6,35.53 V1.2
N$21
  Top 0.2: R8.2 58.5,67.9 C44.1 62,68.4 65.9,64.5 65.9,57.15 R12.1
N$23
  Top 0.2: R7.2 57,67.9 C43.1 56.5,69.5 56.9,69.9 61.2,69.9 66.3,64.8 66.3,57.85 R13.1
N$24
  Top 0.2: C49.2 60.75,61.55 R9.1 59.5,61.4 | IC1.33 57.85,59.85 58.6,60.6 59.4,60.6 59.5,60.7 59.5,61.4 | IC1.34 57.75,60.35 58.8,61.4 59.5,61.4
N$25
  Top 1: V1.4 C7.1 L2.P$1
N$26
  Top 1: C2.1 92.6,41.75 | 92.6,41.75 91.35,41.75 89.6,43.5 C7.2 L4.P$1 | V1.3 92.6,41.75
N$27
  Top 0.2: IC1.37 56.65,62.05 58.5,63.9 59.8,63.9 60,64.1 R10.1
N$28
  Top 0.2: IC1.36 56.85,61.65 58.7,63.5 61,63.5 61.5,64 R11.1
N$29
  Top 0.2: R1.1 62.7,59.7 | 62.7,59.7 C50.1 | 62.7,59.7 62.7,65.35 R11.2
N$30
  Top 0.2: R2.1 64.2,57.9 64.7,58.4 65.3,58.4 65.5,58.6 65.5,60.9 64.4,62 C49.1 64.4,65.3 62.3,67.4 60.85,67.4 R10.2
N$31
  Top 0.2: IC1.48 48.8,62.05 R16.2
N$32
  Top 0.3: R16.1 C52.2 44.95,62.98 IC7.3
N$33
  Top 0.3: R14.2 46.34,67.11 IC7.4 44.95,68.62 C51.1 45.12,68.95 R15.2
N$34
  Top 0.3: IC7.1 43.05,64.95 44,65.9 44,67.83 C51.2 43.12,70.38 R17.2
N$35
  Top 0.2: IC1.46 51.65,62.75 50.7,63.7 R3.2
  Top 0.3: R3.2 51.75,68.15 52.5,68.9 D1.C D2.A
N$36
  Top 1: L2.P$2 96.2,52.45 L3.1
N$37  (via drill 0.3)
  Top 0.2: IC1.35 57.35,60.85 v57.9,61.4
  Top 0.3: R4.2 D4.A v41.1,65.8
  Bottom 0.3: v41.1,65.8 46.9,60 56.5,60 v57.9,61.4
N$38
  Top 0.3: Q2.1 29.35,52.65 48.7,33.3 48.7,29.55 IC6.95
N$39
  Top 0.3: D4.C D3.A
N$41
  Top 0.3: IC6.97 46.3,28.56 46.3,29.3 42.3,33.3 38.9,33.3 16.4,55.8 16.4,59.27 DISPLAY.2
N$43
  Top 0.3: IC6.98 45.8,28.77 45.8,29 42,32.8 38.7,32.8 15.8,55.7 15.8,57.33 DISPLAY.4
N$44
  Top 0.3: IC6.1 14.73,56.05 DISPLAY.6
N$45
  Top 0.3: IC6.2 16.57,53.51 DISPLAY.8
N$46  (via drill 0.3 pad 0.6)
  Top 0.3: DISPLAY.34 18.31,20.49 29.2,9.6 v29.2,9.1 | v33.2,13.1 33.2,13.34 IC6.32
  Bottom 0.3: DISPLAY.22 13.31,34.5 11.5,34.5 9.7,32.7 9.7,20.7 11.2,19.2 13.25,19.2 DISPLAY.34 | v29.2,9.1 v33.2,13.1
N$47
  Top 0.3: IC6.3 18.4,50.97 DISPLAY.10
N$48
  Top 0.3: IC6.4 20.23,48.43 DISPLAY.12
N$49
  Top 0.3: IC6.5 38.13,29.83 22.07,45.89 DISPLAY.14
N$50
  Top 0.3: DISPLAY.16 19.2,38.69 19.2,25.9 33.4,11.7 35.8,11.7 IC6.38
N$51  (via drill 0.3 pad 0.6)
  Top 0.3: IC6.31 33.55,14.4 31.4,14.4 20.2,25.6 v20.2,25.9
  Bottom 0.3: DISPLAY.26 13.3,29.41 13.3,27.7 12.5,26.9 11.5,26.9 10.7,26.1 10.7,25 11.4,24.3 13.27,24.3 DISPLAY.30 14.87,25.9 v20.2,25.9
N$52  (via drill 0.3 pad 0.6)
  Top 0.3: IC6.30 33.34,14.9 31.6,14.9 23.9,22.6 v23.9,23
  Bottom 0.3: DISPLAY.18 13.3,39.57 13.3,37.5 13.8,37 15.3,37 15.8,36.5 15.8,32.6 15.1,31.9 11.2,31.9 10.2,30.9 10.2,22.6 11.1,21.7 13.21,21.7 DISPLAY.32 14.57,23 v23.9,23
N$53
  Top 0.3: IC6.12 37,26.01 37,26.8 35.2,28.6 34.29,28.6 Q3.1 33.09,28.92 C14.1
N$54
  Top 0.3: IC6.13 37,25.3 34.45,25.3 C15.1 34.4,25.56 Q3.3
N$55
  Top 0.3: R21.2 84.81,13.02 X1.2
N$56
  Top 0.3: R22.2 82.25,14.3 85.56,14.3 X1.3
N$58
  Top 1: L4.P$2 86,52.45 L5.1
N$59  (via drill 0.3)
  Top 0.2: IC1.32 59.2,59.35 59.38,59.52 | 59.38,59.52 R9.2 v59.5,58.5 | C50.2 59.55,59.7 59.38,59.52 | v55,63.4 55,63 54.65,62.65 IC1.40
  Bottom 0.3: v55,63.4 57.8,63.4 59.5,61.7 v59.5,58.5
N$60  (via drill 0.3)
  Top 0.3: C25.1 v61.1,25.4 R29.2 58.55,26.6 56.2,26.6 54.4,24.8 v54.4,22.2 | IC6.14 v38.39,23.2 v38.4,23.2 | v39.9,21.7 41.9,19.7 51.9,19.7 52.6,19 53.1,19 v54.4,20.3
  Bottom 0.3: J1.3 61.1,22.07 v61.1,25.4 | v38.4,23.2 v39.9,21.7 | v54.4,20.3 v54.4,22.2
N$61
  Top 1: R30.1 10.62,9.48 10,10.1 10,13.41 DISPLAY.37
N$62
  Top 0.3: DISPLAY.13 12,45.2 13.3,43.9 13.3,42.8 14,42.1 14.9,42.1 18.7,38.3 18.7,25.7 33.2,11.2 36.01,11.2 IC6.39
N$63
  Top 0.3: DISPLAY.15 12,42.6 13.3,41.3 13.3,40.3 14.1,39.5 15.2,39.5 18.2,36.5 18.2,25.5 33,10.7 36.21,10.7 IC6.40
N$64
  Top 0.3: DISPLAY.17 12,40.2 13.3,38.9 13.3,37.5 13.8,37 15,37 17.7,34.3 17.7,25.3 32.8,10.2 36.42,10.2 IC6.41
N$65
  Top 0.3: DISPLAY.19 12,37.5 13.2,36.3 13.2,35.2 14,34.4 15,34.4 17.2,32.2 17.2,25.1 32.6,9.7 36.63,9.7 IC6.42
N$66
  Bottom 1: X1.1 84.83,22.41 JP1.2
N$67
  Top 1: R6.1 18.72,69.87 SG1.+ 31.45,75.65 D5.C
N$68
  Top 0.3: DISPLAY.21 12,35 13.3,33.7 13.3,32.5 13.9,31.9 15.1,31.9 16.7,30.3 16.7,24.9 32.4,9.2 36.84,9.2 IC6.43
N$69
  Top 0.3: DISPLAY.23 12,32.6 13.3,31.3 13.3,30.1 14,29.4 15.2,29.4 16.2,28.4 16.2,24.7 32.2,8.7 37.04,8.7 IC6.44
N$70
  Top 0.3: DISPLAY.25 12,29.8 13.3,28.5 13.3,27.5 13.9,26.9 15,26.9 15.7,26.2 15.7,24.5 32,8.2 37.25,8.2 IC6.45
N$71
  Top 0.3: DISPLAY.27 12,27.3 13.2,26.1 13.2,25.1 14,24.3 15.2,24.3 31.8,7.7 37.46,7.7 IC6.46
N$72
  Top 1: SG1.- 30.45,69.15 | 30.45,69.15 D5.A | Q2.3 30.3,69 30.45,69.15
RX
  Top 0.3: IC6.69 52.34,14.2 59.59,14.2 UART.1
SD_CS  (via drill 0.3 pad 0.6)
  Top 0.3: DISPLAY.36 20.05,17.95 26.1,11.9 v26.1,11.4 | v31.2,16.5 32.12,16.5 IC6.26
  Bottom 0.3: v26.1,11.4 v31.2,16.5
SWCLK  (via drill 0.3)
  Top 0.3: v61.1,16.3 58.4,16.3 57.6,17.1 57.6,20.3 56.7,21.2 53.78,21.2 IC6.76
  Bottom 0.3: J1.4 61.1,18.93 v61.1,16.3
SWDIO  (via drill 0.3)
  Top 0.3: v56.8,19.7 56.8,16.2 56.4,15.8 52.86,15.8 IC6.72
  Bottom 0.3: J1.2 60.6,19.7 v56.8,19.7
TFT_CS  (via drill 0.3 pad 0.6)
  Top 0.3: v20.2,26.9 27.62,26.9 IC6.24
  Bottom 0.3: DISPLAY.29 13.33,26.9 v20.2,26.9
TFT_RD  (via drill 0.3 pad 0.6)
  Top 0.3: IC6.9 38.2,26.93 38.2,27.6 23.2,42.6 18.9,42.6 v17.9,43.6
  Bottom 0.3: v17.9,43.6 17.9,45.1 15.8,47.2 13.23,47.2 DISPLAY.11
TFT_RS
  Top 0.3: IC6.7 39.2,27.34 39.2,28 22.6,44.6 14,44.6 13.3,45.3 13.3,52.21 DISPLAY.7
TFT_RST  (via drill 0.3 pad 0.6)
  Top 0.3: IC6.25 32.02,21.8 v26,21.8
  Bottom 0.3: DISPLAY.33 12.89,20.49 14.2,21.8 v26,21.8
TFT_WR  (via drill 0.3 pad 0.6)
  Top 0.3: IC6.8 38.7,27.14 38.7,27.8 22.9,43.6 v19.4,43.6
  Bottom 0.3: v19.4,43.6 19.4,45.9 15.6,49.7 13.27,49.7 DISPLAY.9
TOUCH_CS  (via drill 0.3 pad 0.6)
  Top 0.3: IC6.10 37.7,26.72 37.7,27.3 26.7,38.3 v20.7,38.3
  Bottom 0.3: v20.7,38.3 14.57,38.3 DISPLAY.20
TOUCH_IRQ  (via drill 0.3 pad 0.6)
  Top 0.3: v20.2,28.1 27.13,28.1 IC6.23
  Bottom 0.3: DISPLAY.28 v20.19,28.11 v20.2,28.1
TX
  Top 0.3: IC6.68 52.14,13.7 57.7,13.7 60.6,10.8 64.35,10.8 UART.3
U+
  Top 0.3: C43.2 55.1,72.8 U+.1
U-
  Top 0.3: C44.2 U-.1
USB_IDENT
  Top 0.3: R5.2 67.2,10.9 66.6,10.3 60.4,10.3 57.5,13.2 51.93,13.2 IC6.67
USB_N
  Top 0.3: IC6.70 52.55,14.7 78,14.7 79.3,13.4 80.05,13.4 R21.1
USB_P
  Top 0.3: IC6.71 52.76,15.2 79.65,15.2 R22.1 81.18,14.42 81.3,14.3 81.3,11.75 R5.1
VCC  (via drill 0.3)
  Top 0.2: 48.23,58.85 48.09,58.71 C34.1 | 58.2,55.5 L9.1 | 58.2,53.83 C18.1
  Top 0.3: IC1.26 57.35,56.35 58.2,55.5 L9.1 58.2,53.83 58.2,49.9 57.12,48.83 C27.1 54.2,48.83 | IC1.6 49,58.85 | 49,58.85 48.23,58.85 48.09,58.71 | 49,58.85 v49,58.4 | C18.1 v59.4,53.8 | IC3.10 54.19,48.84 54.2,48.83 | IC3.16 50.38,49.28 50.2,49.1 50.2,48.5 50.7,48 51.4,48 52.23,48.83 54.2,48.83
  Top 1: IC2.2 91,66.8 | 91,66.8 IC2.4 | 91,66.8 90.8,66.6 C17.1 84,66.6 70.1,52.7 60.7,52.7 59.6,53.8 C18.1
  Bottom 0.3: v59.4,53.8 56,57.2 50.2,57.2 v49,58.4

### Text on the board
tPlace: ON/OFF / Switch
tNames: RX | TX | B2 | B11 | B13 | B15 | D9 | D11 | D13 | D15 | C7 | C9 | 5V | 3V3 | B1 | D8 | C6 | C8 | GND | B10 | B12 | B14 | D10 | D12 | D14 | GND
bNames: I+ | I- | U+ | U- | 03/2020 | github.com/jankae/LCR | LCR Meter